# Altium schematic sheet Worst case.SchDoc
size A4
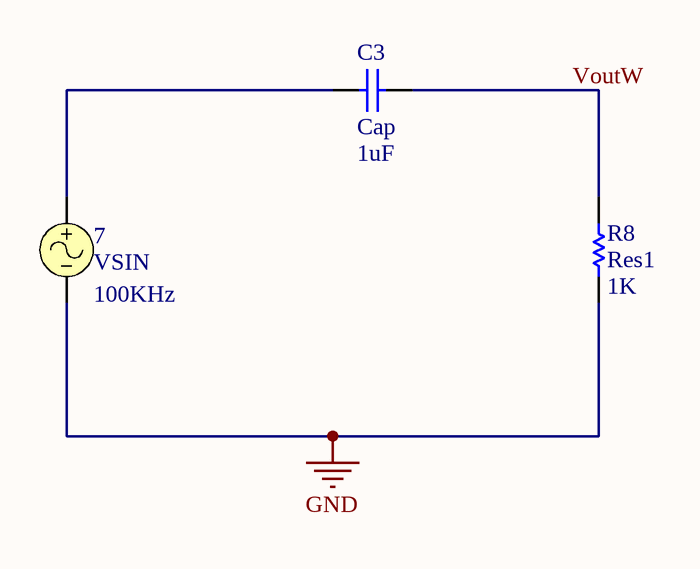
[diagram p0: Worst case.SchDoc]

## Parts
7  VSIN  Frequency: 100KHz
C3  Cap  value 1uF  [RAD-0.3]
R8  Res1  value 1K  [AXIAL-0.3]

## Nets
GND: 7.2 R8.1
VoutW: C3.2 R8.2
Net7_1: 7.1 C3.1

## Library data of the parts
7 = VSIN: Sinusoidal Voltage Source; Note: PCB Footprint - Not required; Published: 8-Jun-2000; LatestRevisionDate: 15-Nov-2004; LatestRevisionNote: Corrected Netlist.; PackageReference: Not Applicable; Publisher: Altium Limited
C3 = Cap: Capacitor; Published: 8-Jun-2000; LatestRevisionDate: 17-Jul-2002; LatestRevisionNote: Re-released for DXP Platform.; PackageReference: RAD-0.3; Publisher: Altium Limited; PackageDescription: Radial Cap, Thru-Hole; 2 Leads; 0.3 in Pin Spacing
R8 = Res1: Resistor; Published: 8-Jun-2000; LatestRevisionDate: 17-Jul-2002; LatestRevisionNote: Re-released for DXP Platform.; PackageReference: AXIAL-0.3; Publisher: Altium Limited; PackageDescription: Axial Device, Thru-Hole; 2 Leads; 0.3 in Pin Spacing